# EasyEDA schematic Therm Controller.json
TITLE: Thermostat Controller; REV: 1.0; Date: 2021-01-31; Sheet: 1/1; Company: Explosive Brains Ltd
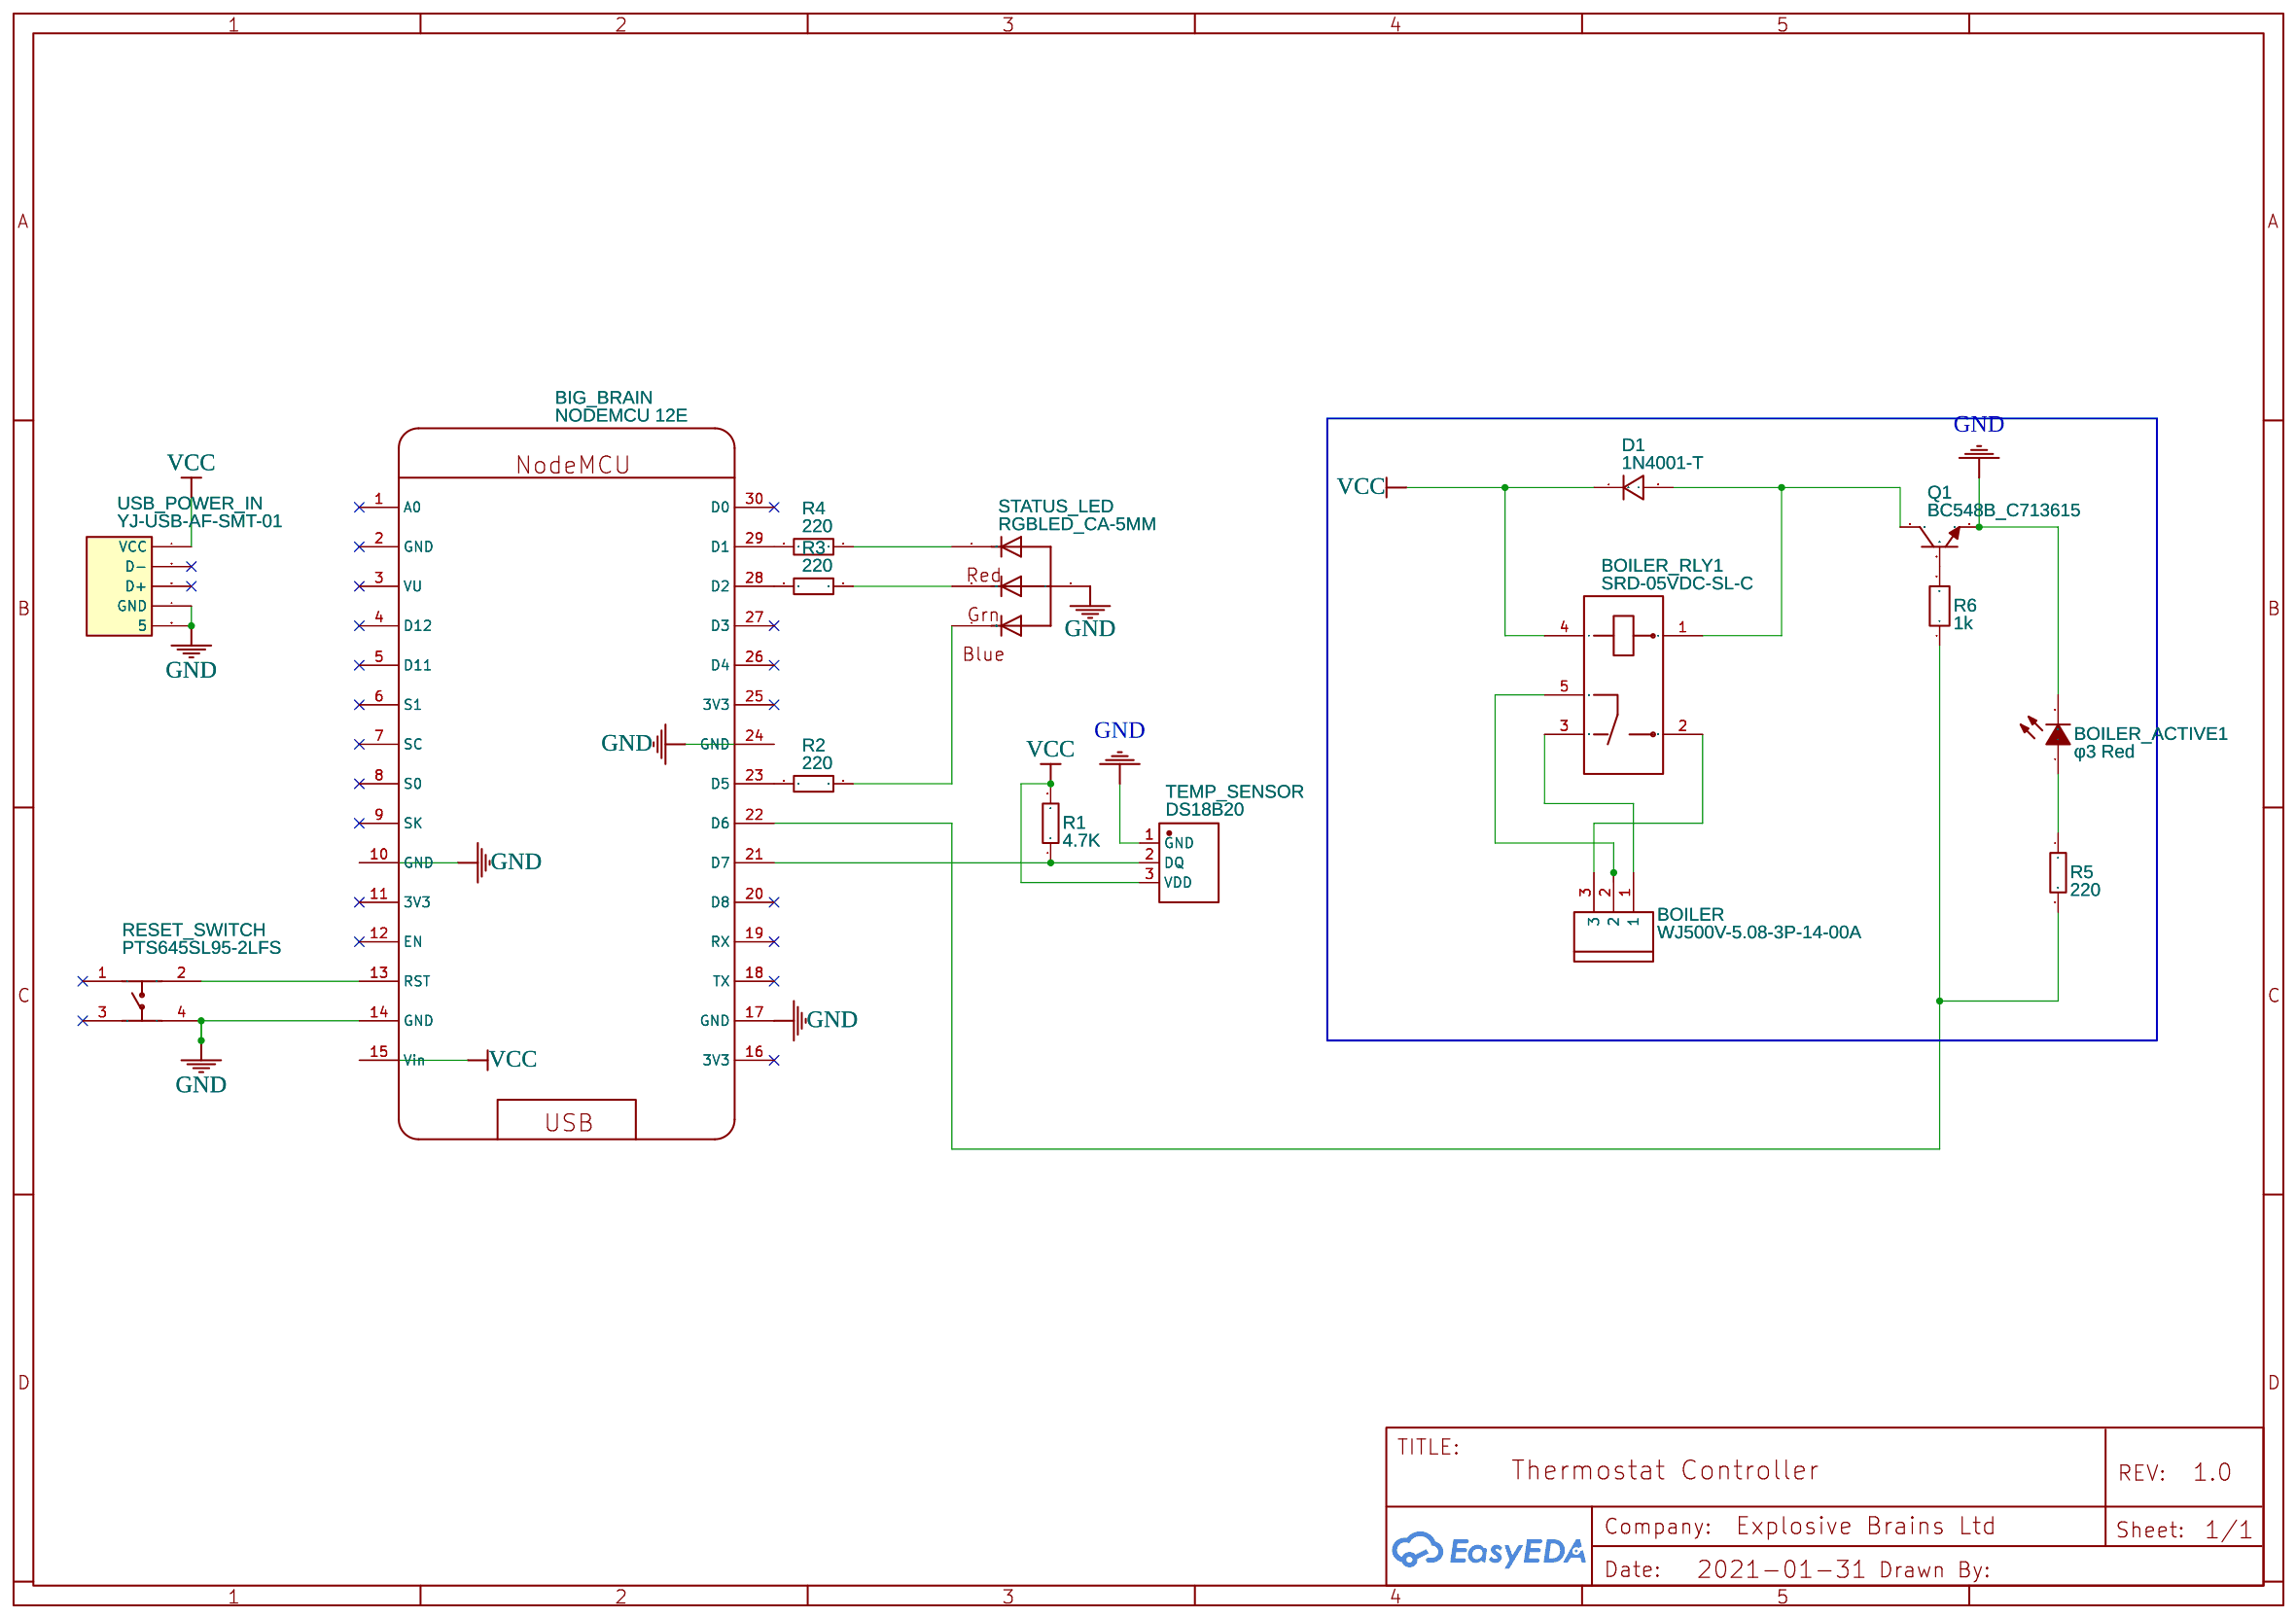
[diagram p0: schematic sheet]

## Parts
BIG_BRAIN  NODEMCU 12E  [NODEMCU]
BOILER  WJ500V-5.08-3P-14-00A  [CONN-TH_3P-P5.00_WJ500V-5.08-3P]
BOILER_ACTIVE1  φ3 Red  [LED-TH_2PIN-L3.50-W3.80-PITCH2.28-L]
BOILER_RLY1  SRD-05VDC-SL-C  [RELAY-TH_SRD-XXVDC-XL-C]
D1  1N4001-T  [IN4001]
Q1  BC548B_C713615  [TO-92-3_L4.9-W3.7-P1.27-L]
R1  4.7K  [RES-TH_BD2.2-L6.5-P10.50-D0.6]
R2  220  [RES-TH_BD2.3-L6.5-P10.50-D0.5]
R3  220  [RES-TH_BD2.3-L6.5-P10.50-D0.5]
R4  220  [RES-TH_BD2.3-L6.5-P10.50-D0.5]
R5  220  [RES-TH_BD2.3-L6.5-P10.50-D0.5]
R6  1k  [RES-TH_BD2.2-L6.5-P10.50-D0.9]
RESET_SWITCH  PTS645SL95-2LFS  [KEY-TH_4P-L6.0-W6.0-P4.50-LS6.5]
STATUS_LED  RGBLED_CA-5MM  [LED5MMRGB]
TEMP_SENSOR  DS18B20  [TO-92-3_L4.9-W3.7-P1.27-L]
USB_POWER_IN  YJ-USB-AF-SMT-01  [USB-A-SMD_FUS270-FSBW5K]

## Library data of the parts
BIG_BRAIN = NODEMCU 12E: Contributor: Byte Electronics
BOILER = WJ500V-5.08-3P-14-00A: Supplier: LCSC; Manufacturer: ReliaPro; image: //image.lceda.cn/szlcsc/C72334.jpg; Supplier Part: C72334
BOILER_ACTIVE1 = φ3 Red: Supplier: LCSC; Manufacturer: KENTO; image: //image.lceda.cn/szlcsc/C39928.jpg; Supplier Part: C39928
BOILER_RLY1 = SRD-05VDC-SL-C: Supplier: LCSC; Manufacturer: SONGLE; image: //image.lceda.cn/szlcsc/C35449.jpg; Supplier Part: C35449
D1 = 1N4001-T COPY: Supplier: LCSC; Supplier Part: C99656; Manufacturer: Diodes Incorporated; Contributor: LCSC
Q1 = BC548B_C713615: Supplier: LCSC; Supplier Part: C713615; Manufacturer: LGE; Manufacturer Part: BC548B; Contributor: LCSC
R1 = CFR0W4J0472A50: Supplier: LCSC; Manufacturer: UniOhm; Supplier Part: C61297; LCSC Assembly: Yes; SMT Type: Extend
R2-R5 = CF1/4W-220Ω±5% T52: Supplier: LCSC; Supplier Part: C120039; Manufacturer: Chian Chia Elec; Contributor: LCSC; LCSC Assembly: Yes; SMT Type: Extend
R6 = CFR0W4J0102A50_C66649: Supplier: LCSC; Supplier Part: C66649; Manufacturer: Uniroyal Elec; Manufacturer Part: CFR0W4J0102A50; Contributor: LCSC; LCSC Assembly: Yes; SMT Type: Extend
RESET_SWITCH = PTS645SL95-2LFS: Supplier: LCSC; Supplier Part: C221879; Manufacturer: C&K; Contributor: LCSC; LCSC Assembly: Yes; SMT Type: Extend
STATUS_LED = RGBLED_CA-5MM: RGB LED, common-anode5MM Staggered pins5mm Piranha package; Contributor: Adafruit
TEMP_SENSOR = DS18B20: Supplier: LCSC; Supplier Part: C376006; Manufacturer: Youtai Semiconductor Co., Ltd.; Contributor: LCSC; LCSC Assembly: Yes; SMT Type: Extend
USB_POWER_IN = YJ-USB-AF-SMT-01: Supplier: LCSC; Manufacturer: ValuePro; image: //image.lceda.cn/szlcsc/C8328.jpg; Supplier Part: C8328

## Nets
GND: BIG_BRAIN.10(GND) BIG_BRAIN.14(GND) BIG_BRAIN.17(GND) BIG_BRAIN.24(GND) BOILER_ACTIVE1.2(C) Q1.3(E) RESET_SWITCH.4 STATUS_LED.2(VCC) TEMP_SENSOR.1(GND) USB_POWER_IN.4(GND) USB_POWER_IN.5
VCC: BIG_BRAIN.15(Vin) BOILER_RLY1.4 D1.1(C) R1.2 TEMP_SENSOR.3(VDD) USB_POWER_IN.1(VCC)
Net-(BIG_BRAIN-13): BIG_BRAIN.13(RST) RESET_SWITCH.2
Net-(BIG_BRAIN-21): BIG_BRAIN.21(D7) R1.1 TEMP_SENSOR.2(DQ)
Net-(BIG_BRAIN-22): BIG_BRAIN.22(D6) R5.2 R6.1
Net-(BIG_BRAIN-23): BIG_BRAIN.23(D5) R2.2
Net-(BIG_BRAIN-28): BIG_BRAIN.28(D2) R3.2
Net-(BIG_BRAIN-29): BIG_BRAIN.29(D1) R4.2
Net-(BOILER-1): BOILER.1 BOILER_RLY1.3
Net-(BOILER-2): BOILER.2 BOILER_RLY1.5
Net-(BOILER-3): BOILER.3 BOILER_RLY1.2
Net-(BOILER_ACTIVE1-1): BOILER_ACTIVE1.1(A) R5.1
Net-(BOILER_RLY1-1): BOILER_RLY1.1 D1.2(A) Q1.1(C)
Net-(Q1-2): Q1.2(B) R6.2
Net-(R2-1): R2.1 STATUS_LED.4(BLUE)
Net-(R3-1): R3.1 STATUS_LED.3(GREEN)
Net-(R4-1): R4.1 STATUS_LED.1(RED)

Not connected (* = marked no-connect by the designer): BIG_BRAIN 1(A0)* 2(GND)* 3(VU)* 4(D12)* 5(D11)* 6(S1)* 7(SC)* 8(S0)* 9(SK)* 11(3V3)* 12(EN)* 16(3V3)* 18(TX)* 19(RX)* 20(D8)* 25(3V3)* 26(D4)* 27(D3)* 30(D0)*; RESET_SWITCH 1* 3*; USB_POWER_IN 2(D-)* 3(D+)*
